# Altium schematic sheet MicroMouse.SchDoc
size C; SheetNumber: 1; SheetTotal: 1
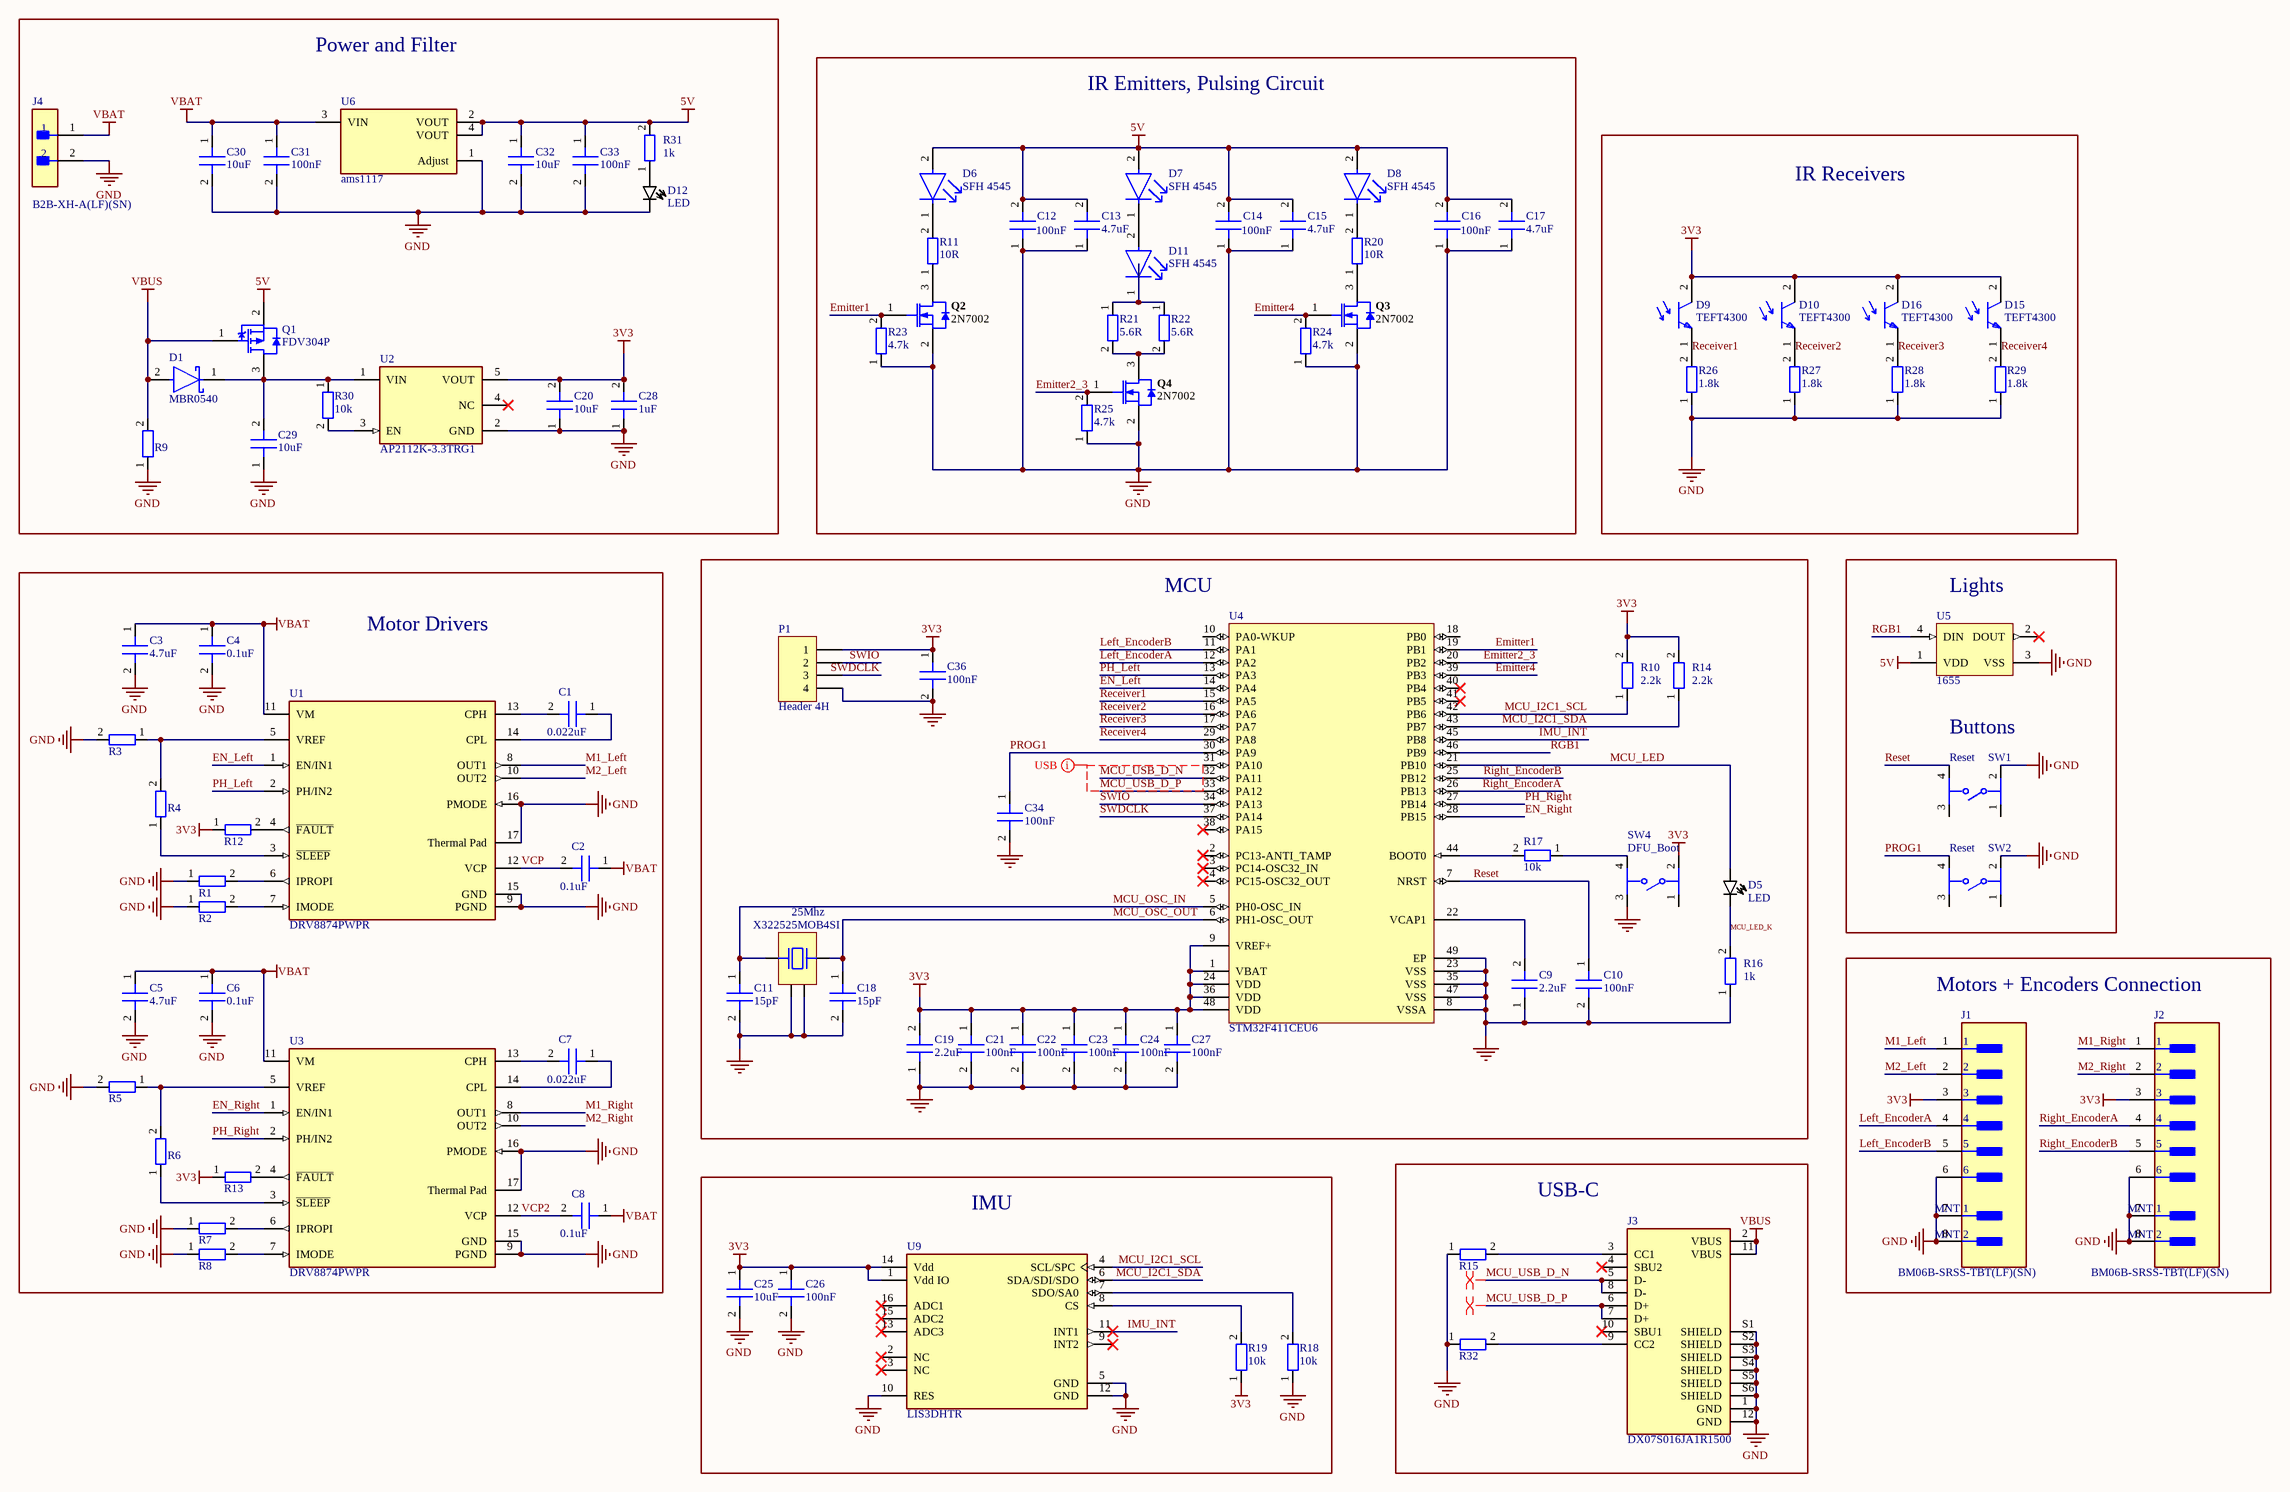
[diagram p0: MicroMouse.SchDoc]

## Parts
C1  0.022uF  [IPC C C0603 No Silk]
C2  0.1uF  [IPC C C0603 No Silk]
C3  4.7uF  [IPC C C0603 No Silk]
C4  0.1uF  [IPC C C0603 No Silk]
C5  4.7uF  [IPC C C0603 No Silk]
C6  0.1uF  [IPC C C0603 No Silk]
C7  0.022uF  [IPC C C0603 No Silk]
C8  0.1uF  [IPC C C0603 No Silk]
C9  2.2uF  [IPC C C0603 No Silk]
C10  100nF  [IPC C C0603 No Silk]
C11  15pF  [IPC C C0603 No Silk]
C12  100nF  [IPC C C0603 No Silk]
C13  4.7uF  [IPC C C0603 No Silk]
C14  100nF  [IPC C C0603 No Silk]
C15  4.7uF  [IPC C C0603 No Silk]
C16  100nF  [IPC C C0603 No Silk]
C17  4.7uF  [IPC C C0603 No Silk]
C18  15pF  [IPC C C0603 No Silk]
C19  2.2uF  [IPC C C0603 No Silk]
C20  10uF  [IPC C C0603 No Silk]
C21  100nF  [IPC C C0603 No Silk]
C22  100nF  [IPC C C0603 No Silk]
C23  100nF  [IPC C C0603 No Silk]
C24  100nF  [IPC C C0603 No Silk]
C25  10uF  [IPC C C0603 No Silk]
C26  100nF  [IPC C C0603 No Silk]
C27  100nF  [IPC C C0603 No Silk]
C28  1uF  [IPC C C0603 No Silk]
C29  10uF  [IPC C C0603 No Silk]
C30  10uF  [IPC C C0603 No Silk]
C31  100nF  [IPC C C0603 No Silk]
C32  10uF  [IPC C C0603 No Silk]
C33  100nF  [IPC C C0603 No Silk]
C34  100nF  [IPC C C0603 No Silk]
C36  100nF  [IPC C C0603 No Silk]
D1  MBR0540  [FP-425-04-MFG]
D5  LED  [LED0603-FD_BLUE]
D6  SFH 4545  [FP-SFH_4556-MFG]
D7  SFH 4545  [FP-SFH_4556-MFG]
D8  SFH 4545  [FP-SFH_4556-MFG]
D9  TEFT4300  [FP-6_544-5269_01-4-MFG]
D10  TEFT4300  [FP-6_544-5269_01-4-MFG]
D11  SFH 4545  [FP-SFH_4556-MFG]
D12  LED  [LED0603-FD_BLUE]
D15  TEFT4300  [FP-6_544-5269_01-4-MFG]
D16  TEFT4300  [FP-6_544-5269_01-4-MFG]
J1  BM06B-SRSS-TBT(LF)(SN)  [FP-BM06B-SRSS-TBT_LF_SN-MFG]
J2  BM06B-SRSS-TBT(LF)(SN)  [FP-BM06B-SRSS-TBT_LF_SN-MFG]
J3  DX07S016JA1R1500  [JAE_DX07S016JA1R1500]
J4  B2B-XH-A(LF)(SN)  [FP-B2B-XH-A_LF_SN-MFG]
P1  Header 4H  [HDR1X4H]
Q1  FDV304P  [FAIR-SOT23-3_V]
Q2  2N7002  [INF-PG-SOT23_M]
Q3  2N7002  [INF-PG-SOT23_M]
Q4  2N7002  [INF-PG-SOT23_M]
R1  2.49k  [IPC C R0603 No Silk]  (value not drawn)
R2  20k  [IPC C R0603 No Silk]  (value not drawn)
R3  0  [IPC C R0603 No Silk]  (value not drawn)
R4  10k  [IPC C R0603 No Silk]  (value not drawn)
R5  0  [IPC C R0603 No Silk]  (value not drawn)
R6  10k  [IPC C R0603 No Silk]  (value not drawn)
R7  2.49k  [IPC C R0603 No Silk]  (value not drawn)
R8  20k  [IPC C R0603 No Silk]  (value not drawn)
R9  100k  [IPC C R0603 No Silk]  (value not drawn)
R10  2.2k  [IPC C R0603 No Silk]
R11  10R  [IPC C R0603 No Silk]
R12  10k  [IPC C R0603 No Silk]  (value not drawn)
R13  10k  [IPC C R0603 No Silk]  (value not drawn)
R14  2.2k  [IPC C R0603 No Silk]
R15  Generic RES 0603  [IPC C R0603 No Silk]  (value not drawn)
R16  1k  [IPC C R0603 No Silk]
R17  10k  [IPC C R0603 No Silk]
R18  10k  [IPC C R0603 No Silk]
R19  10k  [IPC C R0603 No Silk]
R20  10R  [IPC C R0603 No Silk]
R21  5.6R  [IPC C R0603 No Silk]
R22  5.6R  [IPC C R0603 No Silk]
R23  4.7k  [IPC C R0603 No Silk]
R24  4.7k  [IPC C R0603 No Silk]
R25  4.7k  [IPC C R0603 No Silk]
R26  1.8k  [IPC C R0603 No Silk]
R27  1.8k  [IPC C R0603 No Silk]
R28  1.8k  [IPC C R0603 No Silk]
R29  1.8k  [IPC C R0603 No Silk]
R30  10k  [IPC C R0603 No Silk]
R31  1k  [IPC C R0603 No Silk]
R32  Generic RES 0603  [IPC C R0603 No Silk]  (value not drawn)
SW1  Reset  [FP-PTS526SK15SMTR2LFS-MFG]
SW2  Reset  [FP-PTS526SK15SMTR2LFS-MFG]
SW4  DFU_Boot  [FP-PTS526SK15SMTR2LFS-MFG]
U1  DRV8874PWPR  [FP-PWP0016J-MFG]
U2  AP2112K-3.3TRG1  [FP-SOT25-IPC_A]
U3  DRV8874PWPR  [FP-PWP0016J-MFG]
U4  STM32F411CEU6  [STM-UFQFPN48_L]
U5  1655  [ADA-RGB-1655_V]
U6  ams1117  [FP-ams1117-IPC_C]
U9  LIS3DHTR  [FP-LGA-16-7983231-MFG]
X322525MOB4SI  25Mhz  [OSC-SMD_4P-L3.2-W2.5-BL]

## Blocks framed on the sheet
Power and Filter: C20 C28-C33 D1 D12 J4 Q1 R9 R30 R31 U2 U6
IR Emitters, Pulsing Circuit: C12-C17 D6-D8 D11 Q2-Q4 R11 R20-R25
IR Receivers: D9 D10 D15 D16 R26-R29
Motor Drivers: C1-C8 R1-R8 R12 R13 U1 U3
MCU: C9-C11 C18 C19 C21-C24 C27 C34 C36 D5 P1 R10 R14 R16 R17 SW4 U4 X322525MOB4SI
Motors + Encoders Connection: J1 J2
IMU: C25 C26 R18 R19 U9
USB-C: J3 R15 R32

## Nets
3V3: C19.2 C20.2 C21.1 C22.1 C23.1 C24.1 C25.1 C26.1 C27.1 C28.2 C36.1 D9.2(C) D10.2(C) D15.2(C) D16.2(C) J1.3 J2.3 P1.1 R10.2 R12.1 R13.1 R14.2 R19.1 SW4.2 U2.5(VOUT) U4.1(VBAT) U4.9(VREF+) U4.24(VDD) U4.36(VDD) U4.48(VDD) U9.1(Vdd_IO) U9.14(Vdd)
5V: C12.2 C13.2 C14.2 C15.2 C16.2 C17.2 C32.1 C33.1 D6.2(A) D7.2(A) D8.2(A) Q1.2(S) R31.2 U5.1(VDD) U6.2(VOUT) U6.4(VOUT)
GND: C3.2 C4.2 C5.2 C6.2 C9.1 C10.2 C11.2 C12.1 C13.1 C14.1 C15.1 C16.1 C17.1 C18.2 C19.1 C20.1 C21.2 C22.2 C23.2 C24.2 C25.2 C26.2 C27.2 C28.1 C29.1 C30.2 C31.2 C32.2 C33.2 C34.2 C36.2 D12.2(C) J1.6 J1.7(MNT_1) J1.8(MNT_2) J2.6 J2.7(MNT_1) J2.8(MNT_2) J3.1(GND) J3.12(GND) J3.S1(SHIELD) J3.S2(SHIELD) J3.S3(SHIELD) J3.S4(SHIELD) J3.S5(SHIELD) J3.S6(SHIELD) J4.2 P1.4 Q2.2(SOURCE) Q3.2(SOURCE) Q4.2(SOURCE) R1.1 R2.1 R3.2 R5.2 R7.1 R8.1 R9.1 R15.1 R16.1 R18.1 R23.1 R24.1 R25.1 R26.1 R27.1 R28.1 R29.1 R32.1 SW1.2 SW2.2 SW4.3 U1.9(PGND) U1.15(GND) U1.16(PMODE) U1.17(Thermal_Pad) U2.2(GND) U3.9(PGND) U3.15(GND) U3.16(PMODE) U3.17(Thermal_Pad) U4.8(VSSA) U4.23(VSS) U4.35(VSS) U4.47(VSS) U4.49(EP) U5.3(VSS) U6.1(Adjust) U9.5(GND) U9.10(RES) U9.12(GND) X322525MOB4SI.2 X322525MOB4SI.4
VBAT: C2.1 C3.1 C4.1 C5.1 C6.1 C8.1 C30.1 C31.1 J4.1 U1.11(VM) U3.11(VM) U6.3(VIN)
VBUS: D1.2(A) J3.2(VBUS) J3.11(VBUS) Q1.1(G) R9.2
Emitter1: Q2.1(GATE) R23.2 U4.19(PB1)
Emitter2_3: Q4.1(GATE) R25.2 U4.20(PB2)
Emitter4: Q3.1(GATE) R24.2 U4.39(PB3)
EN_Left: U1.1(EN/IN1) U4.14(PA4)
EN_Right: U3.1(EN/IN1) U4.28(PB15)
IMU_INT: U4.45(PB8) U9.11(INT1)
Left_EncoderA: J1.4 U4.12(PA2)
Left_EncoderB: J1.5 U4.11(PA1)
M1_Left: J1.1 U1.8(OUT1)
M1_Right: J2.1 U3.8(OUT1)
M2_Left: J1.2 U1.10(OUT2)
M2_Right: J2.2 U3.10(OUT2)
MCU_I2C1_SCL: R10.1 U4.42(PB6) U9.4(SCL/SPC)
MCU_I2C1_SDA: R14.1 U4.43(PB7) U9.6(SDA/SDI/SDO)
MCU_LED: D5.1(A) U4.21(PB10)
MCU_LED_K: D5.2(C) R16.2
MCU_OSC_IN: C11.1 U4.5(PH0-OSC_IN) X322525MOB4SI.1
MCU_OSC_OUT: C18.1 U4.6(PH1-OSC_OUT) X322525MOB4SI.3
MCU_USB_D_N: J3.5(D-) J3.8(D-) U4.32(PA11)
MCU_USB_D_P: J3.6(D+) J3.7(D+) U4.33(PA12)
PH_Left: U1.2(PH/IN2) U4.13(PA3)
PH_Right: U3.2(PH/IN2) U4.27(PB14)
PROG1: C34.1 SW2.4 U4.30(PA9)
Receiver1: D9.1(E) R26.2 U4.15(PA5)
Receiver2: D10.1(E) R27.2 U4.16(PA6)
Receiver3: D16.1(E) R28.2 U4.17(PA7)
Receiver4: D15.1(E) R29.2 U4.29(PA8)
Reset: C10.1 SW1.4 U4.7(NRST)
RGB1: U4.46(PB9) U5.4(DIN)
Right_EncoderA: J2.4 U4.26(PB13)
Right_EncoderB: J2.5 U4.25(PB12)
SWDCLK: P1.3 U4.37(PA14)
SWIO: P1.2 U4.34(PA13)
VCP: C2.2 U1.12(VCP)
VCP2: C8.2 U3.12(VCP)
NetC1_1: C1.1 U1.14(CPL)
NetC1_2: C1.2 U1.13(CPH)
NetC7_1: C7.1 U3.14(CPL)
NetC7_2: C7.2 U3.13(CPH)
NetC9_2: C9.2 U4.22(VCAP1)
NetC29_2: C29.2 D1.1(C) Q1.3(D) R30.1 U2.1(VIN)
NetD6_1: D6.1(C) R11.2
NetD7_1: D7.1(C) D11.2(A)
NetD8_1: D8.1(C) R20.2
NetD11_1: D11.1(C) R21.1 R22.1
NetD12_1: D12.1(A) R31.1
NetJ3_3: J3.3(CC1) R15.2
NetJ3_9: J3.9(CC2) R32.2
NetQ2_3: Q2.3(DRAIN) R11.1
NetQ3_3: Q3.3(DRAIN) R20.1
NetQ4_3: Q4.3(DRAIN) R21.2 R22.2
NetR1_2: R1.2 U1.6(IPROPI)
NetR2_2: R2.2 U1.7(IMODE)
NetR3_1: R3.1 R4.2 U1.5(VREF)
NetR4_1: R4.1 U1.3(~{SLEEP})
NetR5_1: R5.1 R6.2 U3.5(VREF)
NetR6_1: R6.1 U3.3(~{SLEEP})
NetR7_2: R7.2 U3.6(IPROPI)
NetR8_2: R8.2 U3.7(IMODE)
NetR12_2: R12.2 U1.4(~{FAULT})
NetR13_2: R13.2 U3.4(~{FAULT})
NetR17_1: R17.1 SW4.4
NetR17_2: R17.2 U4.44(BOOT0)
NetR18_2: R18.2 U9.7(SDO/SA0)
NetR19_2: R19.2 U9.8(CS)
NetR30_2: R30.2 U2.3(EN)

Not connected (* = marked no-connect by the designer): J3 4(SBU2)* 10(SBU1)*; SW1 1 3; SW2 1 3; SW4 1; U2 4(NC)*; U4 2(PC13-ANTI_TAMP)* 3(PC14-OSC32_IN)* 4(PC15-OSC32_OUT)* 10(PA0-WKUP) 18(PB0) 31(PA10) 38(PA15)* 40(PB4)* 41(PB5)*; U5 2(DOUT)*; U9 2(NC)* 3(NC)* 9(INT2)* 13(ADC3)* 15(ADC2)* 16(ADC1)*

## Layout directives
net class USB: MCU_USB_D_N, MCU_USB_D_P
differential pair: MCU_USB_D_N, MCU_USB_D_P

## Notes on the sheet
- (near U5) Lights
- Buttons

## Library data of the parts
C1 C3-C7 = CMP-026-000001-1: Value: ?F; Convert to PCB: yes; Add into BOM: yes; Source: Schlib1.SchLib; Design Item ID: Generic CAP 0603; Supplier Footprint: 0402
C2 C8 = CMP-026-000001-1: 16V rated; Value: ?F; Convert to PCB: yes; Add into BOM: yes; Source: Schlib1.SchLib; Design Item ID: Generic CAP 0603; Supplier Footprint: 0402
C9-C34 C36 = CMP-026-000001-1: Convert to PCB: yes; Value: ?F; Add into BOM: yes; Source: Schlib1.SchLib; Design Item ID: Generic CAP 0603; Supplier Footprint: 0402
D1 = CMP-2000-05114-2: DIODE SCHOTTKY 40V 500MA SOD123; Max Surge Current: 5.5A; Max Reverse Leakage Current: 20uA; Forward Voltage: 620mV; Element Configuration: Single; Polarity: Standard; Power Dissipation: 400mW; Current Rating: 500A; Max Operating Temperature: 125°C; REACH SVHC: No SVHC; Voltage Rating (DC): 40V; Mount: Surface Mount; Max Reverse Voltage (DC): 40V; Max Forward Surge Current (Ifsm): 5.5A; Height: 1.03mm; Package Quantity: 3000; Forward Current: 500mA; Average Rectified Current: 500mA; Weight: 0.03g; Output Current: 500mA; Contact Plating: Tin; Packaging: Tape and Reel; Width: 1.6mm; Radiation Hardening: No; Peak Non-Repetitive Surge Current: 5.5A; Max Repetitive Reverse Voltage (Vrrm): 40V; Length: 2.7mm; Lead Free: Lead Free; Min Operating Temperature: -65°C; Number of Pins: 2; Peak Reverse Current: 20uA
D5 D12 = CMP-030-000001-1: Convert to PCB: yes; Design Item ID: Generic LED 0603; Source: Schlib1.SchLib; Supplier Footprint: 0603; Add into BOM: yes
D6-D8 D11 = CMP-62016-000017-1: EMITTER IR 860NM 100MA RADIAL; Manufacturer: Osram Opto; Colour: Infrared; Viewing Angle: 40°; Reverse Voltage: 12V; Led Orientation: Straight; Forward Voltage: 1.5V; Automotive: No; Octopart: https://octopart.com/sfh+4556-osram+opto-31094094; ComponentLink2URL: https://dammedia.osram.info/media/resource/hires/osram-dam-2496340/SFH%204556.pdf; Temperature: -40°C to +100°C; Device Class L1: Optoelectronics; RoHS: TRUE; Manufacturer Part Number: SFH 4556; Peak Emmision Wavelength: 860nm; Temperature Range Low: -40°C; Device Class L2: LEDs; Package: SFH 4556; ComponentLink2Description: Datasheet; Device Class L3: unset; Digikey Description: EMITTER IR 860NM 100MA RADIAL; Forward Current: 100mA; Mouser Description: SFH 4556 Osram Opto, 860nm IR LED, 5mm (T-1 3/4) Through Hole package; Lead Free: Yes; Temperature Range High: +100°C; Category: Diode
D9 D10 D15 D16 = CMP-00030-39729854-1: TEFT4300 PHOTOTRANSISTOR 3.0MM WIDE VIEW / Phototransistor IR Chip Silicon 925nm 2-Pin T-1; Polarity: NPN; Lens Style: Domed; Max Power Dissipation: 100mW; Viewing Angle: 30°; Collector Emitter Breakdown Voltage: 70V; Number of Elements: 1; Rise Time: 2µs; Dark Current: 200nA; Collector Emitter Saturation Voltage: 300mV; Fall Time: 2.3µs; Max Collector Current: 50mA; Max Operating Temperature: 100°C; Schedule B: 8541407080, 8541407080; Min Operating Temperature: -40°C; Orientation: Top View; Height: 4.5mm; Radiation Hardening: No; Power Consumption: 100mW; RoHS: Compliant; Case/Package: T; Lead Free: Lead Free; REACH SVHC: Unknown; NexarPartId: 39729854; Mount: Through Hole; Wavelength: 925nm; Power Dissipation: 100mW; Number of Channels: 1; Number of Pins: 2; Collector Emitter Voltage (VCEO): 70V; Width: 3.9mm; Length: 3.2mm
J1 J2 = CMP-17439-000255-1: CONN HEADER SMD 6POS 1MM; Voltage Rating: 50V; Number of Positions: 6; Current Rating: 1A; Gender: Male; Contact Resistance: 20mR; Insulation Resistance: 100MR; Mated Stacking Heights: 4.9mm; Number of Rows: 1; Contact Type: Male Pin; Pitch: 1mm; Length: 8mm; Max Operating Temperature: 85°C; Mount: Surface Mount; Material: Polyamide; Depth: 3.6mm; Housing Color: Natural; Orientation: Straight; Termination: Solder; Package Quantity: 1; Min Operating Temperature: -25°C; Contact Shape: Square; Insulation Color: Natural; Connector Type: Header; Max Voltage Rating (DC): 50V; Insulation Material: Nylon; Flammability Rating: UL94 V-0; Color: Natural; Contact Plating: Tin; Lead Free: Lead Free; Packaging: Tape and Reel; Contact Material: Copper Alloy; Series: SR; Housing Material: Polyamide; Contact Finish - Mating: TIN; Max Voltage Rating (AC): 50V; Fastening Type: Pull; Max Current Rating: 1A
J3 = CMP-044-000001-1: USB-C (USB TYPE-C) USB 2.0 Receptacle Connector 24 (16+8 Dummy) Position Surface Mount, Right Angle; Through Hole; Source: DX07S016JA1R1500.SchLib; Price: None; MP: DX07S016JA1R1500; Value: *; Design Item ID: DX07S016JA1R1500; Package: None; Component Type: Standard; Pin Count: 18; Availability: Unavailable
J4 = CMP-2000-05888-3: CONN HEADER VERT 2POS 2.5MM; Current Rating: 3A; Voltage Rating: 250V; Number of Contacts: 2; Contact Resistance: 20mR; Wire/Cable Gauge: 22AWG; Insulation Resistance: 1GR; Connector Type: Male Pin; Packaging: Bulk; Contact Material: Brass; Lead Free: Lead Free; Orientation: Straight; Contact Plating: Tin; Max Current Rating: 3A; Termination: Solder; Fastening Type: Detent; Depth: 5.75mm; Housing Material: Polyamide; REACH SVHC: No SVHC; Series: XH; Voltage Rating (AC): 250V; Number of Positions: 2; Color: Natural; Contact Type: Male Pin; Max Voltage Rating (DC): 250V; Pitch: 2.5mm; Lead Pitch: 2.5mm; Mount: Through Hole; Max Operating Temperature: 85°C; Length: 7.4mm; Max Voltage Rating (AC): 250V; Min Operating Temperature: -25°C; Number of Rows: 1; Housing Color: White
P1 = CMP-007-000098-1: Header, 4-Pin, Right Angle; Signal Integrity: Connector; Design Item ID: Header 4H; Component Type: Standard; Publisher: Altium Limited; Pin Count: 4; Source: Miscellaneous Connectors.SchLib; LatestRevisionNote: Re-released for DXP Platform.; LatestRevisionDate: 17-Jul-2002
Q1 = CMP-2000-06263-1: P-Channel Digital FET, -25 V, -0.46 A, 0.35 W, -55 to 150 degC, 3-Pin SOT-23, -55 to 150 degC, RoHS, Tape and Reel; Manufacturer: FairchildSemiconductor; Rad Hard: No; Typical Fall Time: 35ns; Typical Rise Time: 8ns; Channel Mode: Enhancement; Maximum Continuous Drain Current: 0.46A; RDS-on: 1100@4.5VmOhm; Maximum Drain Source Voltage: 25V; Package Version: Rev. 12, 03/2016; Typical Turn-On Delay Time: 6ns; Maximum Gate Source Voltage: 8V; Channel Type: P; Typical Turn-Off Delay Time: 55ns; Datasheet Version: Rev. E1, 08/1997; Package Description: 3-Pin Small Outline Transistor, Body 2.92 x 1.325 mm, Pitch 0.95 mm; Operating Temperature: -55to150°C; Package Reference: SOT23-3; Manufacturer URL: https://www.fairchildsemi.com/; Package URL: http://www.fairchildsemi.com/dwg/MA/MA03D.pdf; Package: 3SOT-23; Category: MOSFET; Packaging: Tape&Reel; Mounting: SurfaceMount; Datasheet URL: https://www.fairchildsemi.com/datasheets/FD/FDV304P.pdf; Mounting Technology: SurfaceMount
Q2-Q4 = CMP-1149-00026-1: N-Channel OptiMOS Small-Signal-Transistor, 60 V VDS, 0.3 A ID, -55 to 150 degC, PG-SOT23, Reel, Green; Manufacturer: Infineon; RDS (on) (max) (@4.5V): 4,000 mOhm; VDS (max): 60 V; IDpuls (max): 1.2Â A; QG: 0.4Â nC; RDS (on) (max): 3,000 mOhm; RthJA (max): 250 K/W; ID (max): 0.3Â A; VGS(th) (max): 2.5Â V; VGS(th) (min): 1.5Â V; Green: TRUE; Ptot (max): 0.5Â W; PackageDescription: 3-Pin Small Outline Transistor Package, 2.9 x 1.3 mm Body, 0.95 mm Pitch; Halogen-free: TRUE; ComponentLink2Description: Datasheet; ComponentLink1URL: http://www.infineon.com/; Packing: Reel; DatasheetVersion: Rev. 2.4; PartNumber: 2N7002; PackageReference: PG-SOT23; PackageVersion: Apr-08; ComponentLink3URL: http://www.infineon.com/dgdl/SOT23-Package_Overview.pdf?folderId=db3a30431936bc4b0119532290053c66&fileId=db3a30431936bc4b0119533468123c85; ComponentLink1Description: Manufacturer URL; Mounting Technology: Surface Mount; ComponentLink3Description: Package Specification; ComponentLink2URL: http://www.infineon.com/dgdl/2N7002_Rev2.4.pdf?folderId=db3a3043156fd573011622e10b5c1f67&fileId=db3a304319bc939a0119c2a9461e79e6
R1-R14 R16-R31 = CMP-032-000001-1: Convert to PCB: yes; Supplier Footprint: 0402; Add into BOM: yes; Value: ?; Source: Schlib1.SchLib; Design Item ID: Generic RES 0603
R15 R32 = CMP-032-000001-1: Convert to PCB: yes; Value: 5.1k; Supplier Footprint: 0402; Add into BOM: yes; Source: Schlib1.SchLib; Design Item ID: Generic RES 0603
SW1 SW2 SW4 = CMP-10040-000013-1: TACT 5.2 X 5.2, 1.5 MM H, 260GF,; Manufacturer: C&K; Manufacturer Part Number: PTS526SK15SMTR2LFS; Operating Force: 250gf; Throw Configuration: SPST-NO; Contact Current Rating: 50mA; Standoff Height: 0mm; Contact Resistance: 100mΩ; Voltage Rating Dc: 12V; Electromechanical Life: 200000Cycles; Device Class L3: Tactile Switches; Device Class L2: Switches; Temperature: -20°C to +70°C; Temperature Range Low: -20°C; Package: PTS526SK15SMTR2LFS; Temperature Range High: +70°C; ComponentLink2Description: Datasheet; Device Class L1: Electromechanical; Height: 1.65mm; Digikey Description: TACT 5.2 X 5.2, 1.5 MM H, 260GF,; Category: Switch; RoHS: TRUE; Automotive: No; Lead Free: Yes; Octopart: https://octopart.com/pts526+sk15+smtr2+lfs-c%26k+components-100617999; ComponentLink2URL: https://www.ckswitches.com/media/2780/pts526.pdf
U1 U3 = CMP-04915-000011-1: DRV8874 H-BRIDGE MOTOR DRIVER; RoHS Compliant: Yes
U2 = CMP-12756-000035-1: IC REG LINEAR 3.3V 600MA SOT25; Number of Regulators: 1; Output Type: Fixed; Polarity: Positive; Min Input Voltage: 2.5V; Max Input Voltage: 6V; Accuracy: 1.5%; Quiescent Current: 55uA; Dropout Voltage: 250mV; Min Operating Temperature: -40°C; Length: 3.1mm; Output Current: 600mA; Max Operating Temperature: 85°C; Package Quantity: 1; Output Voltage: 3.3V; Width: 1.7mm; Number of Outputs: 1; Packaging: Tape and Reel; Height: 1.3mm; Lead Free: Lead Free; Max Output Current: 600mA; Case/Package: SOT-23-5; Mount: Surface Mount; Number of Pins: 5
U4 = CMP-0243-00165-1: ARM Cortex-M4 32-bit MCU+FPU, 512 KB Flash, 128 KB RAM, 36 I/Os, 48-Pin UFQFPN, -40 to 85 degC, Tray; Operating Frequency(F) (Processor speed) (MHz): 100; FLASH Size (Prog) (kB): 512; Internal RAM Size (kB): 128; I/Os (High Current): 36; Supply Voltage(Vcc) min (V): 1.7; Package Reference: 48-Pin Ultra Thin Fine Pitch Quad Flat No-Lead, 7 x 7 x 0.6 mm Body, 0.5 mm Pitch, Exposed Pad; ComponentLink1Description: Manufacturer URL; ComponentLink1URL: http://www.st.com/; Packing: Tray; Package Description: UFQFPN48; Core: ARM Cortex-M4; ComponentLink2Description: Datasheet; ComponentLink2URL: http://www.st.com/st-web-ui/static/active/en/resource/technical/document/datasheet/DM00115249.pdf; DatasheetVersion: Rev. 6; Mounting Technology: Surface Mount
U5 = CMP-2000-05026-1: Intelligent Control LED Integrated Light Source, 3.5 to 5.3 V, -25 to 80 degC, 4-Pin SMD, RoHS, Tape and Reel; Manufacturer: Adafruit-Industries-LLC; Number of LEDs: 10; Configuration: Discrete; Utilized LED: WS2812(5050); Datasheet URL: http://datasheet.octopart.com/ADA1655-Adafruit-Industries-datasheet-32028139.pdf; Series: Neopixel; Interface: -; Package Description: 4-Pin Surface Mount Device, Body 5 x 5 mm; Color: Red,Green,Blue(RGB); Category: Optoelectronics; Controller Type: -; Package Reference: 1655; Manufacturer URL: https://www.adafruit.com/; Mounting Type: SurfaceMount; Datasheet Version: May-13; Size / Dimension: 5.00mmLx5.00mmW; Family: Addressable,Specialty
U6 = CMP-209535-000002-1: 1A LOW DROPOUT VOLTAGE REGULATOR; RoHS Compliant: Yes
U9 = CMP-0234-00055-6: ACCEL 2-16G I2C/SPI 16LGA; Max Supply Voltage: 3.6V; Bandwidth: 5kHz; Min Supply Voltage (DC): 1.71V; Interface: I2C; Axis: X, Y, Z; Operating Supply Voltage: 2.5V; Operating Supply Current: 11uA; Output Type: Digital; Resolution: 16b; Sensor Type: 3 Axis; Series: -; Package Quantity: 1; Case/Package: LGA; Radiation Hardening: No; Min Operating Temperature: -40°C; Length: 3mm; Max Supply Voltage (DC): 3.6V; Lead Free: Lead Free; Height: 1mm; Number of Pins: 16; RoHS Compliant: Yes; Packaging: Tape and Reel; Width: 3mm; Contact Plating: Gold; Max Operating Temperature: 85°C; Min Supply Voltage: 1.71V; REACH SVHC: No SVHC; Depth: 3mm
X322525MOB4SI = Crystal 25MHz X322525MOB4SI: Crystal Type:SMD Crystal Resonator Frequency: Frequency Tolerance:±10ppm Frequency Tolerance:±10ppm Frequency Stability:±30ppm Frequency Stability:±30ppm Load Capacitance: Operating Temperature: Operating Temperature:; Manufacturer: YXC(扬兴晶振); Add into BOM: yes; Frequency Tolerance: ±10ppm; Frequency Stability: ±30ppm; Value: 25MHz; Symbol: X322525MOB4SI; Device: X322525MOB4SI; LCSC Part Name: 25MHz ±10ppm 12pF; Supplier Part: C9006; Manufacturer Part: X322525MOB4SI; Supplier Footprint: SMD3225-4P; JLCPCB Part Class: Basic Part; Datasheet: https://atta.szlcsc.com/upload/public/pdf/source/20210329/C112971_1F611BDC486E193C1706F6D8EB5AA189.pdf; Supplier: LCSC; Convert to PCB: yes; Crystal Type: SMD Crystal Resonator